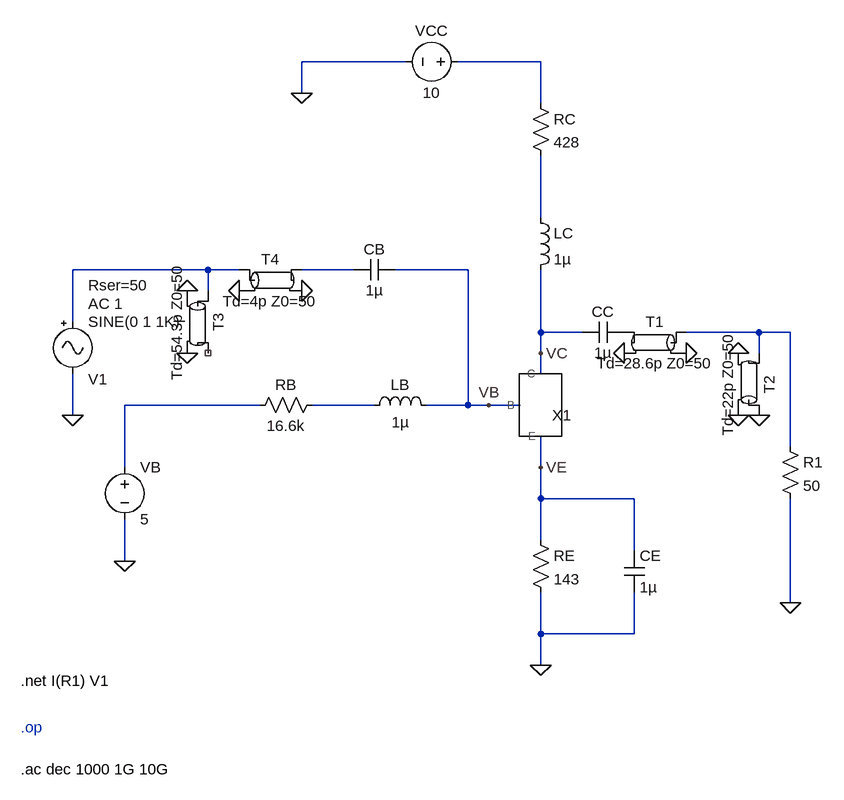
[diagram p0: schematic Circuit_LinhasStubs.asc]
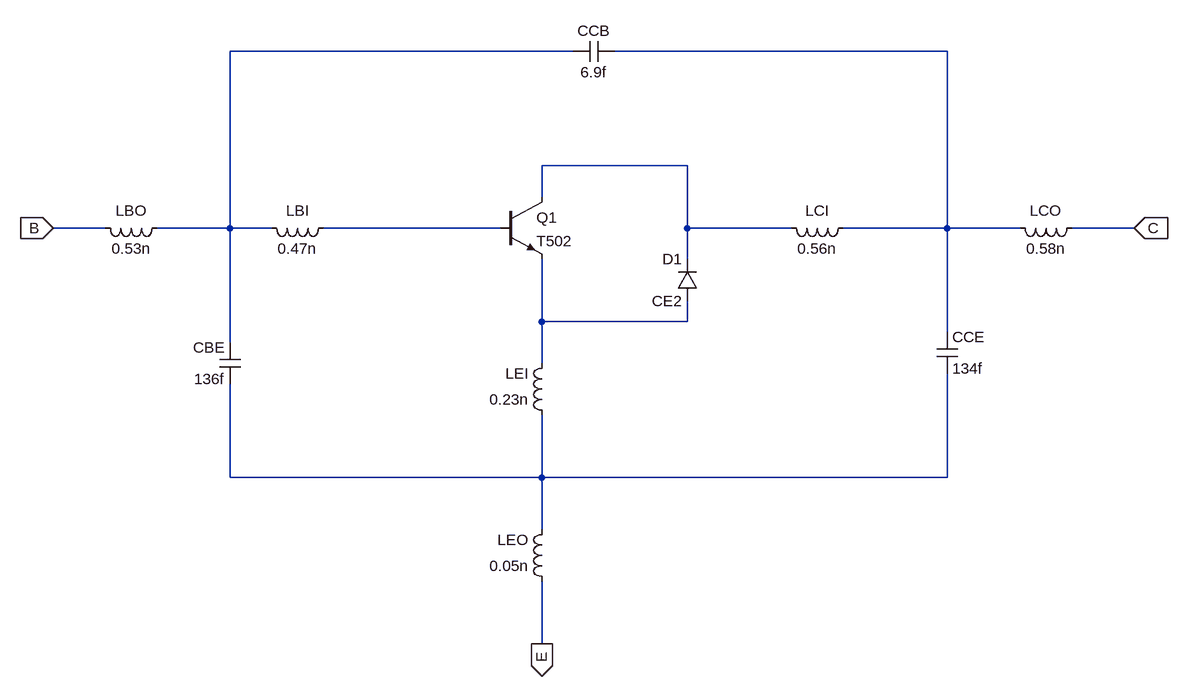
[diagram p1: sub-circuit t502.asc]
Circuit_LinhasStubs.asc, the LTspice schematic file:
Version 4
SHEET 1 1196 736
WIRE 0 -368 -160 -368
WIRE 208 -368 80 -368
WIRE -160 -320 -160 -368
WIRE 208 -304 208 -368
WIRE 208 -128 208 -224
WIRE -304 -48 -512 -48
WIRE -256 -48 -304 -48
WIRE -80 -48 -160 -48
WIRE 96 -48 -16 -48
WIRE -304 -16 -304 -48
WIRE -512 32 -512 -48
WIRE 208 48 208 -48
WIRE 272 48 208 48
WIRE 544 48 432 48
WIRE 592 48 544 48
WIRE 208 80 208 48
WIRE 544 80 544 48
WIRE 208 112 208 80
WIRE -224 160 -432 160
WIRE -48 160 -144 160
WIRE 96 160 96 -48
WIRE 96 160 32 160
WIRE 128 160 96 160
WIRE 176 160 128 160
WIRE -512 176 -512 112
WIRE 592 224 592 48
WIRE -432 256 -432 160
WIRE 208 256 208 208
WIRE 208 304 208 256
WIRE 352 304 208 304
WIRE 208 368 208 304
WIRE 352 384 352 304
WIRE -432 400 -432 336
WIRE 592 464 592 304
WIRE 208 512 208 448
WIRE 352 512 352 448
WIRE 352 512 208 512
WIRE 208 560 208 512
FLAG -432 400 0
FLAG 208 560 0
FLAG 592 464 0
FLAG -160 -320 0
FLAG -512 176 0
FLAG 128 160 VB
FLAG 208 80 VC
FLAG 208 256 VE
FLAG 432 80 0
FLAG 336 80 0
FLAG 512 176 0
FLAG 512 80 0
FLAG -336 -16 0
FLAG -336 80 0
FLAG -256 -16 0
FLAG -160 -16 0
FLAG 544 176 0
SYMBOL T502 208 160 R0
SYMATTR InstName X1
SYMBOL res 192 -320 R0
SYMATTR InstName RC
SYMATTR Value 428
SYMBOL res 576 208 R0
SYMATTR InstName R1
SYMATTR Value 50
SYMBOL res 192 352 R0
SYMATTR InstName RE
SYMATTR Value 143
SYMBOL res -128 144 R90
WINDOW 0 0 56 VBottom 2
WINDOW 3 32 56 VTop 2
SYMATTR InstName RB
SYMATTR Value 16.6k
SYMBOL ind -64 176 R270
WINDOW 0 32 56 VTop 2
WINDOW 3 5 56 VBottom 2
SYMATTR InstName LB
SYMATTR Value 1µ
SYMBOL ind 192 -144 R0
SYMATTR InstName LC
SYMATTR Value 1µ
SYMBOL cap 336 384 R0
SYMATTR InstName CE
SYMATTR Value 1µ
SYMBOL cap 336 32 R90
WINDOW 0 0 32 VBottom 2
WINDOW 3 32 32 VTop 2
SYMATTR InstName CC
SYMATTR Value 1µ
SYMBOL cap -16 -64 R90
WINDOW 0 0 32 VBottom 2
WINDOW 3 32 32 VTop 2
SYMATTR InstName CB
SYMATTR Value 1µ
SYMBOL voltage -432 240 R0
WINDOW 123 0 0 Left 0
WINDOW 39 0 0 Left 0
SYMATTR InstName VB
SYMATTR Value 5
SYMBOL voltage 96 -368 R90
WINDOW 0 -32 56 VBottom 2
WINDOW 3 32 56 VTop 2
WINDOW 123 0 0 Left 0
WINDOW 39 0 0 Left 0
SYMATTR InstName VCC
SYMATTR Value 10
SYMBOL Misc\\signal -512 16 R0
WINDOW 0 24 104 Left 2
WINDOW 3 24 16 Left 2
WINDOW 123 24 -12 Left 2
WINDOW 39 24 -40 Left 2
SYMATTR InstName V1
SYMATTR Value2 AC 1
SYMATTR SpiceLine Rser=50
SYMBOL tline 384 64 M0
SYMATTR InstName T1
SYMATTR Value Td=28.6p Z0=50
SYMBOL tline 528 128 M270
SYMATTR InstName T2
SYMATTR Value Td=22p Z0=50
SYMBOL tline -320 32 R90
SYMATTR InstName T3
SYMATTR Value Td=54.3p Z0=50
SYMBOL tline -208 -32 R0
SYMATTR InstName T4
SYMATTR Value Td=4p Z0=50
TEXT -592 720 Left 2 !.ac dec 1000 1G 10G
TEXT -592 656 Left 2 ;.op
TEXT -592 584 Left 2 !.net I(R1) V1

t502.asc, the sub-circuit schematic file:
Version 4
SHEET 1 1260 872
WIRE 320 -112 -208 -112
WIRE 896 -112 384 -112
WIRE 496 64 272 64
WIRE 272 112 272 64
WIRE -400 160 -480 160
WIRE -208 160 -208 -112
WIRE -208 160 -320 160
WIRE -144 160 -208 160
WIRE 208 160 -64 160
WIRE 496 160 496 64
WIRE 656 160 496 160
WIRE 896 160 896 -112
WIRE 896 160 736 160
WIRE 1008 160 896 160
WIRE 1184 160 1088 160
WIRE 496 208 496 160
WIRE 272 304 272 208
WIRE 496 304 496 272
WIRE 496 304 272 304
WIRE 896 320 896 160
WIRE -208 336 -208 160
WIRE 272 368 272 304
WIRE -208 544 -208 400
WIRE 272 544 272 448
WIRE 272 544 -208 544
WIRE 896 544 896 384
WIRE 896 544 272 544
WIRE 272 624 272 544
WIRE 272 800 272 704
FLAG -480 160 B
IOPIN -480 160 In
FLAG 1184 160 C
IOPIN 1184 160 In
FLAG 272 800 E
IOPIN 272 800 Out
SYMBOL npn 208 112 R0
SYMATTR InstName Q1
SYMATTR Value T502
SYMBOL diode 512 272 R180
WINDOW 0 24 64 Left 2
WINDOW 3 24 0 Left 2
SYMATTR InstName D1
SYMATTR Value CE2
SYMBOL ind -48 144 R90
WINDOW 0 5 56 VBottom 2
WINDOW 3 32 56 VTop 2
SYMATTR InstName LBI
SYMATTR Value 0.47n
SYMBOL ind 752 144 R90
WINDOW 0 5 56 VBottom 2
WINDOW 3 32 56 VTop 2
SYMATTR InstName LCI
SYMATTR Value 0.56n
SYMBOL ind -304 144 R90
WINDOW 0 5 56 VBottom 2
WINDOW 3 32 56 VTop 2
SYMATTR InstName LBO
SYMATTR Value 0.53n
SYMBOL ind 1104 144 R90
WINDOW 0 5 56 VBottom 2
WINDOW 3 32 56 VTop 2
SYMATTR InstName LCO
SYMATTR Value 0.58n
SYMBOL ind 288 464 R180
WINDOW 0 36 80 Left 2
WINDOW 3 36 40 Left 2
SYMATTR InstName LEI
SYMATTR Value 0.23n
SYMBOL ind 288 720 R180
WINDOW 0 36 80 Left 2
WINDOW 3 36 40 Left 2
SYMATTR InstName LEO
SYMATTR Value 0.05n
SYMBOL cap 880 320 R0
SYMATTR InstName CCE
SYMATTR Value 134f
SYMBOL cap 384 -128 R90
WINDOW 0 0 32 VBottom 2
WINDOW 3 32 32 VTop 2
SYMATTR InstName CCB
SYMATTR Value 6.9f
SYMBOL cap -192 400 R180
WINDOW 0 24 56 Left 2
WINDOW 3 24 8 Left 2
SYMATTR InstName CBE
SYMATTR Value 136f

The netlist it stands for:
* Circuit_LinhasStubs.asc
XX1 VB VE VC t502
RC N001 N002 428
R1 N005 0 50
RE VE 0 143
RB N007 N006 16.6k
LB N007 VB 1µ
LC N002 VC 1µ
CE VE 0 1µ
CC P001 VC 1µ
CB VB N004 1µ
VB N006 0 5
VCC N001 0 10
V1 N003 0 SINE(0 1 1K) AC 1 Rser=50
T1 N005 0 P001 0 Td=28.6p Z0=50
T2 0 0 N005 0 Td=22p Z0=50
T3 N003 0 NC_01 0 Td=54.3p Z0=50
T4 N003 0 N004 0 Td=4p Z0=50

* block symbol definitions
.subckt t502 B E C
Q1 N003 N004 N005 0 T502
D1 N005 N003 CE2
LBI N004 N001 0.47n
LCI N002 N003 0.56n
LBO N001 B 0.53n
LCO C N002 0.58n
LEI N006 N005 0.23n
LEO E N006 0.05n
CCE N002 N006 134f
CCB N002 N001 6.9f
CBE N006 N001 136f
.ends t502

.model D D
.lib standard.dio
.model NPN NPN
.model PNP PNP
.lib standard.bjt
.ac dec 1000 1G 10G
* .op
.net I(R1) V1
.backanno
.end